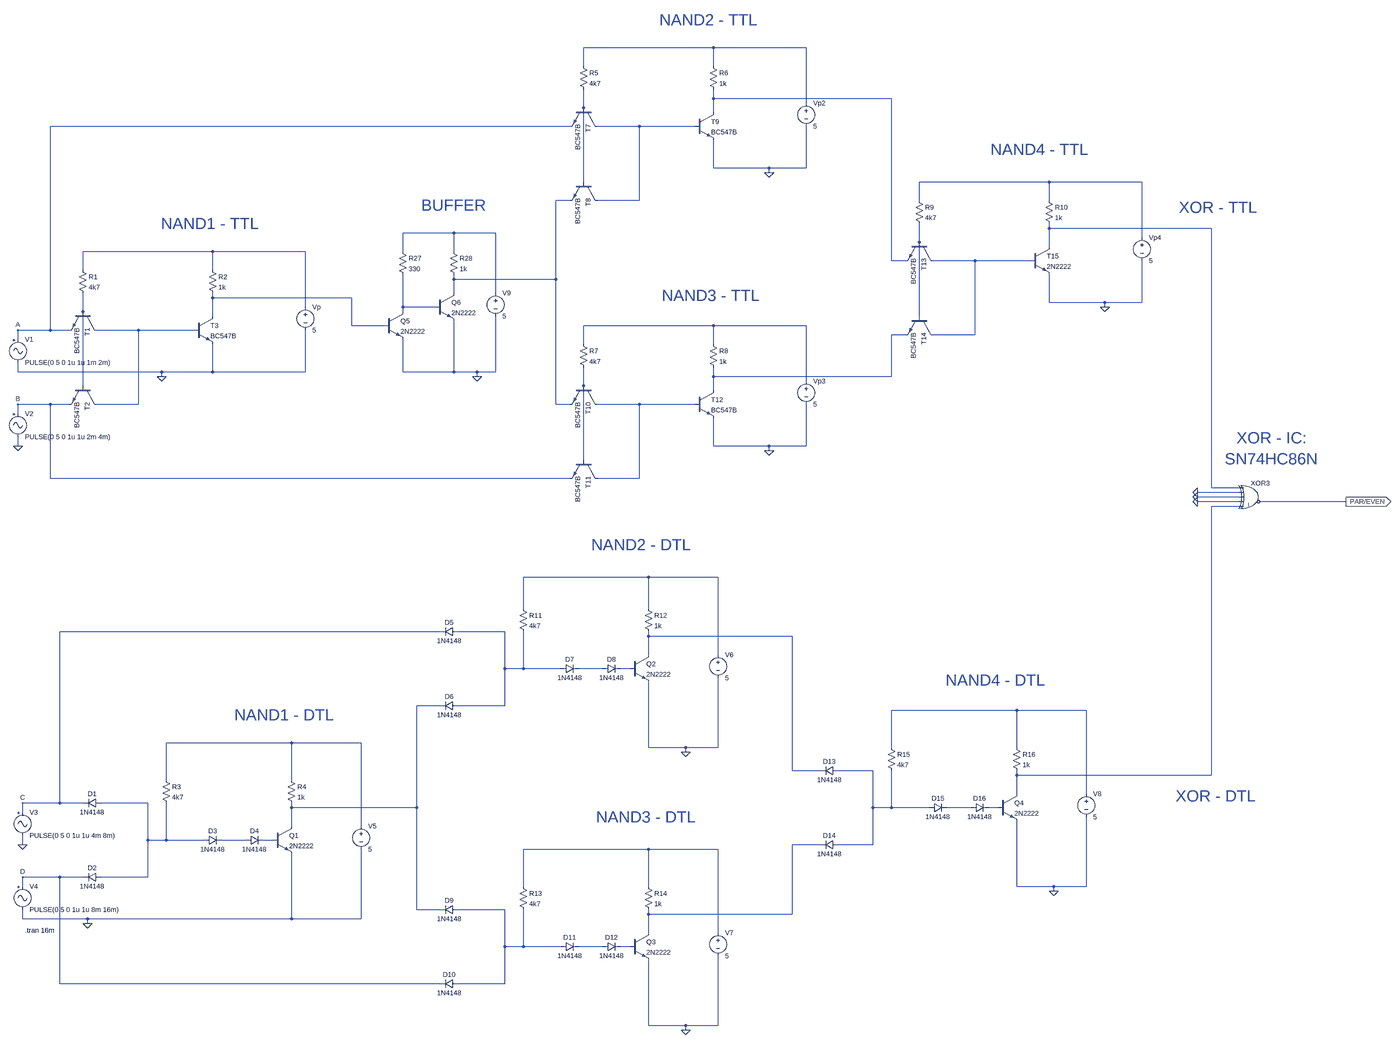
[diagram p0: schematic circuit.asc, whole sheet]
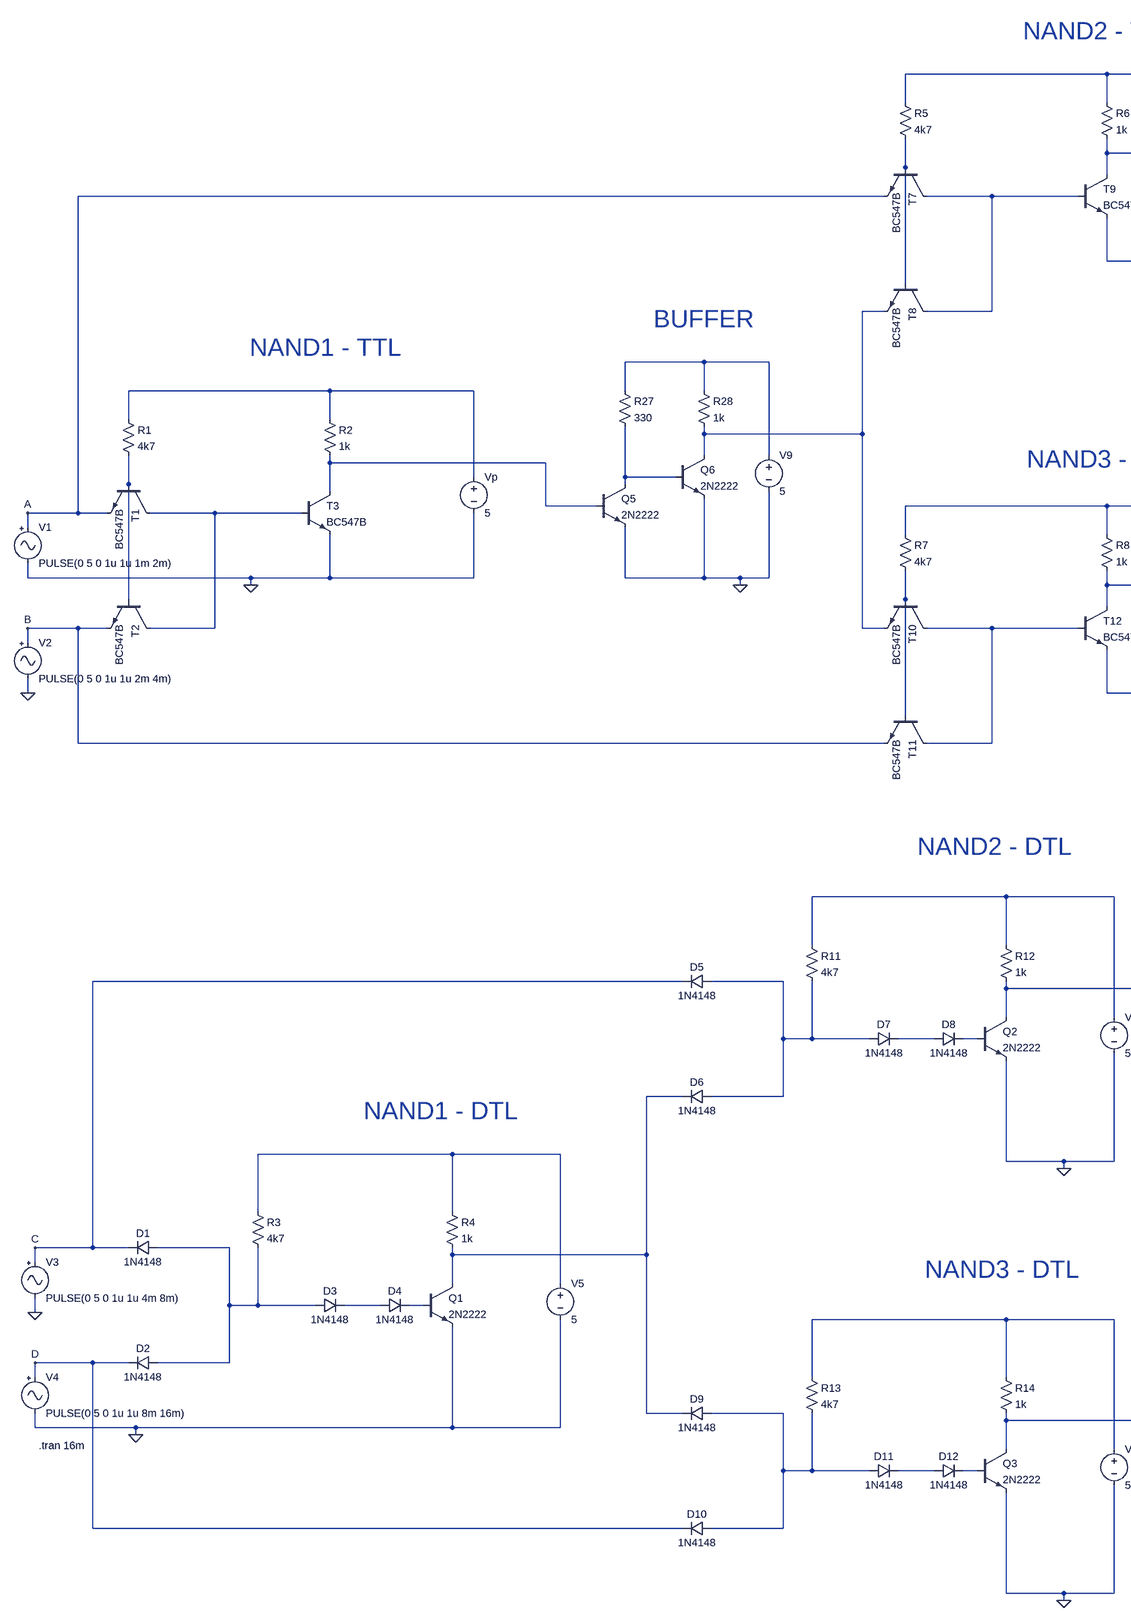
[diagram p1: schematic circuit.asc, part, row 1 of 1, column 1 of 2]
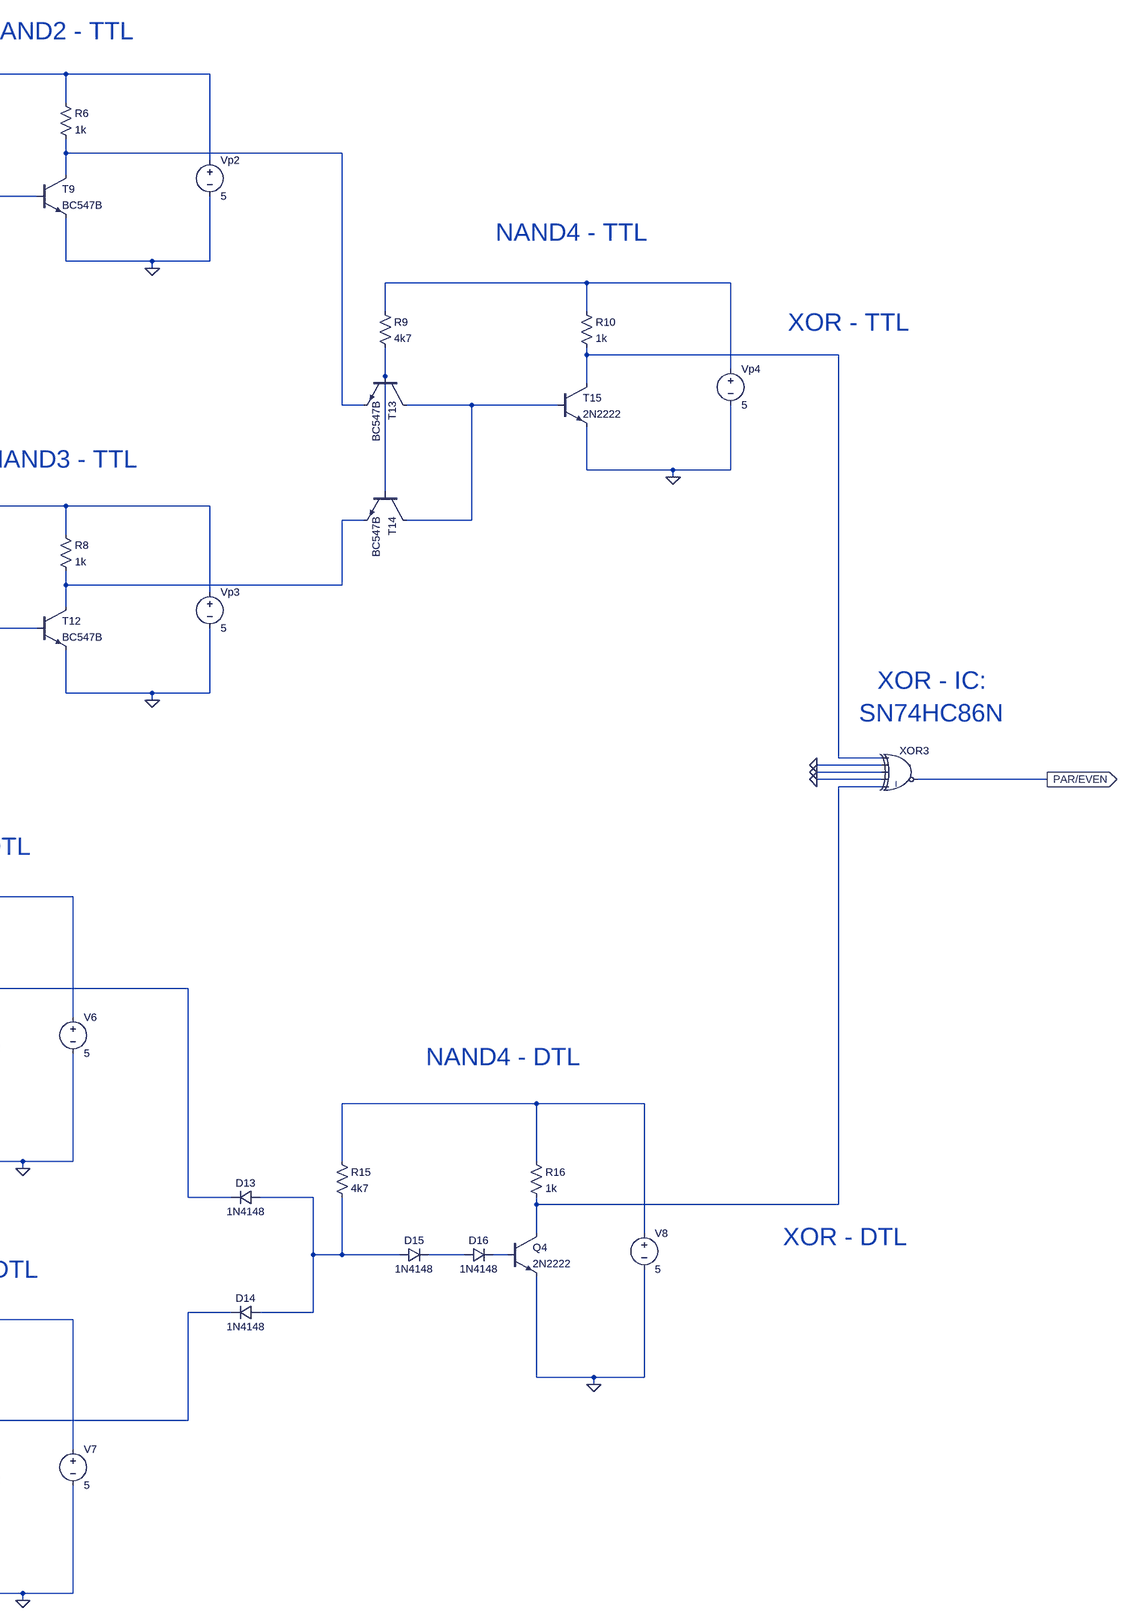
[diagram p2: schematic circuit.asc, part, row 1 of 1, column 2 of 2]
circuit.asc, the LTspice schematic file:
Version 4.1
SHEET 1 9480 2244
WIRE 1440 -1488 992 -1488
WIRE 1760 -1488 1440 -1488
WIRE 992 -1424 992 -1488
WIRE 1440 -1424 1440 -1488
WIRE 1440 -1312 1440 -1344
WIRE 2096 -1312 1440 -1312
WIRE 1760 -1296 1760 -1488
WIRE 992 -1280 992 -1344
WIRE 1440 -1264 1440 -1312
WIRE 944 -1216 -848 -1216
WIRE 1184 -1216 1040 -1216
WIRE 1376 -1216 1184 -1216
WIRE 1440 -1072 1440 -1168
WIRE 1632 -1072 1440 -1072
WIRE 1760 -1072 1760 -1216
WIRE 1760 -1072 1632 -1072
WIRE 1632 -1056 1632 -1072
WIRE 992 -1024 992 -1280
WIRE 2640 -1024 2192 -1024
WIRE 2960 -1024 2640 -1024
WIRE 944 -960 896 -960
WIRE 1184 -960 1184 -1216
WIRE 1184 -960 1040 -960
WIRE 2192 -960 2192 -1024
WIRE 2640 -960 2640 -1024
WIRE 2640 -864 2640 -880
WIRE 3200 -864 2640 -864
WIRE 544 -848 368 -848
WIRE 688 -848 544 -848
WIRE 2960 -832 2960 -1024
WIRE 2192 -816 2192 -880
WIRE 2640 -800 2640 -864
WIRE -288 -784 -736 -784
WIRE 32 -784 -288 -784
WIRE 368 -784 368 -848
WIRE 544 -784 544 -848
WIRE 2096 -752 2096 -1312
WIRE 2144 -752 2096 -752
WIRE 2384 -752 2240 -752
WIRE 2576 -752 2384 -752
WIRE -736 -720 -736 -784
WIRE -288 -720 -288 -784
WIRE 544 -688 544 -704
WIRE 896 -688 896 -960
WIRE 896 -688 544 -688
WIRE 544 -640 544 -688
WIRE 688 -640 688 -848
WIRE -288 -624 -288 -640
WIRE 192 -624 -288 -624
WIRE 2640 -608 2640 -704
WIRE 2832 -608 2640 -608
WIRE 2960 -608 2960 -752
WIRE 2960 -608 2832 -608
WIRE 32 -592 32 -784
WIRE 368 -592 368 -704
WIRE 480 -592 368 -592
WIRE 2832 -592 2832 -608
WIRE -736 -576 -736 -640
WIRE 368 -576 368 -592
WIRE -288 -560 -288 -624
WIRE 2192 -560 2192 -816
WIRE 192 -528 192 -624
WIRE 304 -528 192 -528
WIRE 1440 -528 992 -528
WIRE 1760 -528 1440 -528
WIRE -848 -512 -848 -1216
WIRE -848 -512 -960 -512
WIRE -784 -512 -848 -512
WIRE -544 -512 -688 -512
WIRE -352 -512 -544 -512
WIRE 2144 -496 2096 -496
WIRE 2384 -496 2384 -752
WIRE 2384 -496 2240 -496
WIRE -960 -480 -960 -512
WIRE 992 -464 992 -528
WIRE 1440 -464 1440 -528
WIRE -960 -368 -960 -400
WIRE -464 -368 -960 -368
WIRE -288 -368 -288 -464
WIRE -288 -368 -464 -368
WIRE 32 -368 32 -512
WIRE 32 -368 -288 -368
WIRE 368 -368 368 -480
WIRE 544 -368 544 -544
WIRE 544 -368 368 -368
WIRE 624 -368 544 -368
WIRE 688 -368 688 -560
WIRE 688 -368 624 -368
WIRE -464 -352 -464 -368
WIRE 624 -352 624 -368
WIRE 1440 -352 1440 -384
WIRE 2096 -352 2096 -496
WIRE 2096 -352 1440 -352
WIRE 1760 -336 1760 -528
WIRE -736 -320 -736 -576
WIRE 992 -320 992 -384
WIRE 1440 -304 1440 -352
WIRE -848 -256 -960 -256
WIRE -784 -256 -848 -256
WIRE -544 -256 -544 -512
WIRE -544 -256 -688 -256
WIRE 896 -256 896 -688
WIRE 944 -256 896 -256
WIRE 1184 -256 1040 -256
WIRE 1376 -256 1184 -256
WIRE -960 -224 -960 -256
WIRE -960 -112 -960 -144
WIRE 1440 -112 1440 -208
WIRE 1632 -112 1440 -112
WIRE 1760 -112 1760 -256
WIRE 1760 -112 1632 -112
WIRE 1632 -96 1632 -112
WIRE 992 -64 992 -320
WIRE -848 0 -848 -256
WIRE 944 0 -848 0
WIRE 1184 0 1184 -256
WIRE 1184 0 1040 0
WIRE 3200 32 3200 -864
WIRE 3296 32 3200 32
WIRE 3296 48 3152 48
WIRE 3296 64 3152 64
WIRE 3296 80 3152 80
WIRE 3664 80 3376 80
WIRE 3296 96 3200 96
WIRE 1216 384 784 384
WIRE 1456 384 1216 384
WIRE 784 512 784 384
WIRE 1216 512 1216 384
WIRE 496 592 -816 592
WIRE 720 592 560 592
WIRE 1216 608 1216 592
WIRE 1712 608 1216 608
WIRE 1216 672 1216 608
WIRE 1456 672 1456 384
WIRE 720 720 720 592
WIRE 784 720 784 592
WIRE 784 720 720 720
WIRE 912 720 784 720
WIRE 1056 720 976 720
WIRE 1152 720 1120 720
WIRE 496 848 416 848
WIRE 720 848 720 720
WIRE 720 848 560 848
WIRE 2528 864 2096 864
WIRE 2768 864 2528 864
WIRE -16 976 -448 976
WIRE 224 976 -16 976
WIRE 1216 992 1216 768
WIRE 1344 992 1216 992
WIRE 1456 992 1456 752
WIRE 1456 992 1344 992
WIRE 2096 992 2096 864
WIRE 2528 992 2528 864
WIRE 1344 1008 1344 992
WIRE 1712 1072 1712 608
WIRE 1808 1072 1712 1072
WIRE 2032 1072 1872 1072
WIRE 2528 1088 2528 1072
WIRE 3200 1088 3200 96
WIRE 3200 1088 2528 1088
WIRE -448 1104 -448 976
WIRE -16 1104 -16 976
WIRE 2528 1152 2528 1088
WIRE 2768 1152 2768 864
WIRE -816 1184 -816 592
WIRE -816 1184 -944 1184
WIRE -736 1184 -816 1184
WIRE -512 1184 -672 1184
WIRE -16 1200 -16 1184
WIRE 416 1200 416 848
WIRE 416 1200 -16 1200
WIRE 2032 1200 2032 1072
WIRE 2096 1200 2096 1072
WIRE 2096 1200 2032 1200
WIRE 2224 1200 2096 1200
WIRE 2368 1200 2288 1200
WIRE 2464 1200 2432 1200
WIRE -944 1216 -944 1184
WIRE -16 1264 -16 1200
WIRE 224 1264 224 976
WIRE -512 1312 -512 1184
WIRE -448 1312 -448 1184
WIRE -448 1312 -512 1312
WIRE -320 1312 -448 1312
WIRE -176 1312 -256 1312
WIRE -80 1312 -112 1312
WIRE -944 1328 -944 1296
WIRE 1808 1328 1712 1328
WIRE 2032 1328 2032 1200
WIRE 2032 1328 1872 1328
WIRE 1216 1344 784 1344
WIRE 1456 1344 1216 1344
WIRE -816 1440 -944 1440
WIRE -736 1440 -816 1440
WIRE -512 1440 -512 1312
WIRE -512 1440 -672 1440
WIRE -944 1472 -944 1440
WIRE 784 1472 784 1344
WIRE 1216 1472 1216 1344
WIRE 2528 1472 2528 1248
WIRE 2656 1472 2528 1472
WIRE 2768 1472 2768 1232
WIRE 2768 1472 2656 1472
WIRE 2656 1488 2656 1472
WIRE 416 1552 416 1200
WIRE 496 1552 416 1552
WIRE 720 1552 560 1552
WIRE 1216 1568 1216 1552
WIRE 1712 1568 1712 1328
WIRE 1712 1568 1216 1568
WIRE -944 1584 -944 1552
WIRE -720 1584 -944 1584
WIRE -16 1584 -16 1360
WIRE -16 1584 -720 1584
WIRE 224 1584 224 1344
WIRE 224 1584 -16 1584
WIRE -720 1600 -720 1584
WIRE 1216 1632 1216 1568
WIRE 1456 1632 1456 1344
WIRE 720 1680 720 1552
WIRE 784 1680 784 1552
WIRE 784 1680 720 1680
WIRE 912 1680 784 1680
WIRE 1056 1680 976 1680
WIRE 1152 1680 1120 1680
WIRE -816 1808 -816 1440
WIRE 496 1808 -816 1808
WIRE 720 1808 720 1680
WIRE 720 1808 560 1808
WIRE 1216 1952 1216 1728
WIRE 1344 1952 1216 1952
WIRE 1456 1952 1456 1712
WIRE 1456 1952 1344 1952
WIRE 1344 1968 1344 1952
FLAG -960 -112 0
FLAG 1632 -1056 0
FLAG 1632 -96 0
FLAG 2832 -592 0
FLAG -944 1328 0
FLAG 1344 1008 0
FLAG 1344 1968 0
FLAG -720 1600 0
FLAG 2656 1488 0
FLAG 3152 48 0
FLAG 3152 64 0
FLAG 3152 80 0
FLAG 3664 80 PAR/EVEN
IOPIN 3664 80 Out
FLAG -464 -352 0
FLAG 624 -352 0
FLAG -960 -512 A
FLAG -960 -256 B
FLAG -944 1184 C
FLAG -944 1440 D
SYMBOL npn -688 -576 R90
SYMATTR InstName T1
SYMATTR Value BC547B
SYMBOL npn -688 -320 R90
SYMATTR InstName T2
SYMATTR Value BC547B
SYMBOL npn -352 -560 R0
SYMATTR InstName T3
SYMATTR Value BC547B
SYMBOL res -752 -736 R0
SYMATTR InstName R1
SYMATTR Value 4k7
SYMBOL res -304 -736 R0
SYMATTR InstName R2
SYMATTR Value 1k
SYMBOL Misc\\signal -960 -496 R0
WINDOW 123 0 0 Left 0
WINDOW 39 0 0 Left 0
SYMATTR InstName V1
SYMATTR Value PULSE(0 5 0 1u 1u 1m 2m)
SYMBOL voltage 32 -608 R0
WINDOW 123 0 0 Left 0
WINDOW 39 24 44 Left 2
SYMATTR InstName Vp
SYMATTR Value 5
SYMBOL Misc\\signal -960 -240 R0
WINDOW 123 0 0 Left 0
WINDOW 39 0 0 Left 0
SYMATTR InstName V2
SYMATTR Value PULSE(0 5 0 1u 1u 2m 4m)
SYMBOL npn 1040 -1280 R90
SYMATTR InstName T7
SYMATTR Value BC547B
SYMBOL npn 1040 -1024 R90
SYMATTR InstName T8
SYMATTR Value BC547B
SYMBOL npn 1376 -1264 R0
SYMATTR InstName T9
SYMATTR Value BC547B
SYMBOL res 976 -1440 R0
SYMATTR InstName R5
SYMATTR Value 4k7
SYMBOL res 1424 -1440 R0
SYMATTR InstName R6
SYMATTR Value 1k
SYMBOL voltage 1760 -1312 R0
WINDOW 123 0 0 Left 0
WINDOW 39 24 44 Left 2
SYMATTR InstName Vp2
SYMATTR Value 5
SYMBOL npn 1040 -320 R90
SYMATTR InstName T10
SYMATTR Value BC547B
SYMBOL npn 1040 -64 R90
SYMATTR InstName T11
SYMATTR Value BC547B
SYMBOL npn 1376 -304 R0
SYMATTR InstName T12
SYMATTR Value BC547B
SYMBOL res 976 -480 R0
SYMATTR InstName R7
SYMATTR Value 4k7
SYMBOL res 1424 -480 R0
SYMATTR InstName R8
SYMATTR Value 1k
SYMBOL voltage 1760 -352 R0
WINDOW 123 0 0 Left 0
WINDOW 39 24 44 Left 2
SYMATTR InstName Vp3
SYMATTR Value 5
SYMBOL npn 2240 -816 R90
SYMATTR InstName T13
SYMATTR Value BC547B
SYMBOL npn 2240 -560 R90
SYMATTR InstName T14
SYMATTR Value BC547B
SYMBOL npn 2576 -800 R0
SYMATTR InstName T15
SYMATTR Value 2N2222
SYMBOL res 2176 -976 R0
SYMATTR InstName R9
SYMATTR Value 4k7
SYMBOL res 2624 -976 R0
SYMATTR InstName R10
SYMATTR Value 1k
SYMBOL voltage 2960 -848 R0
WINDOW 123 0 0 Left 0
WINDOW 39 24 44 Left 2
SYMATTR InstName Vp4
SYMATTR Value 5
SYMBOL Misc\\signal -944 1200 R0
WINDOW 123 0 0 Left 0
WINDOW 39 0 0 Left 0
SYMATTR InstName V3
SYMATTR Value PULSE(0 5 0 1u 1u 4m 8m)
SYMBOL Misc\\signal -944 1456 R0
WINDOW 123 0 0 Left 0
WINDOW 39 0 0 Left 0
SYMATTR InstName V4
SYMATTR Value PULSE(0 5 0 1u 1u 8m 16m)
SYMBOL diode -672 1168 R90
WINDOW 0 0 32 VBottom 2
WINDOW 3 32 32 VTop 2
SYMATTR InstName D1
SYMATTR Value 1N4148
SYMBOL diode -672 1424 R90
WINDOW 0 0 32 VBottom 2
WINDOW 3 32 32 VTop 2
SYMATTR InstName D2
SYMATTR Value 1N4148
SYMBOL res -464 1088 R0
SYMATTR InstName R3
SYMATTR Value 4k7
SYMBOL diode -320 1328 R270
WINDOW 0 32 32 VTop 2
WINDOW 3 0 32 VBottom 2
SYMATTR InstName D3
SYMATTR Value 1N4148
SYMBOL diode -176 1328 R270
WINDOW 0 32 32 VTop 2
WINDOW 3 0 32 VBottom 2
SYMATTR InstName D4
SYMATTR Value 1N4148
SYMBOL npn -80 1264 R0
SYMATTR InstName Q1
SYMATTR Value 2N2222
SYMBOL res -32 1088 R0
SYMATTR InstName R4
SYMATTR Value 1k
SYMBOL voltage 224 1248 R0
SYMATTR InstName V5
SYMATTR Value 5
SYMBOL diode 560 576 R90
WINDOW 0 0 32 VBottom 2
WINDOW 3 32 32 VTop 2
SYMATTR InstName D5
SYMATTR Value 1N4148
SYMBOL diode 560 832 R90
WINDOW 0 0 32 VBottom 2
WINDOW 3 32 32 VTop 2
SYMATTR InstName D6
SYMATTR Value 1N4148
SYMBOL res 768 496 R0
SYMATTR InstName R11
SYMATTR Value 4k7
SYMBOL diode 912 736 R270
WINDOW 0 32 32 VTop 2
WINDOW 3 0 32 VBottom 2
SYMATTR InstName D7
SYMATTR Value 1N4148
SYMBOL diode 1056 736 R270
WINDOW 0 32 32 VTop 2
WINDOW 3 0 32 VBottom 2
SYMATTR InstName D8
SYMATTR Value 1N4148
SYMBOL npn 1152 672 R0
SYMATTR InstName Q2
SYMATTR Value 2N2222
SYMBOL res 1200 496 R0
SYMATTR InstName R12
SYMATTR Value 1k
SYMBOL voltage 1456 656 R0
SYMATTR InstName V6
SYMATTR Value 5
SYMBOL diode 560 1536 R90
WINDOW 0 0 32 VBottom 2
WINDOW 3 32 32 VTop 2
SYMATTR InstName D9
SYMATTR Value 1N4148
SYMBOL diode 560 1792 R90
WINDOW 0 0 32 VBottom 2
WINDOW 3 32 32 VTop 2
SYMATTR InstName D10
SYMATTR Value 1N4148
SYMBOL res 768 1456 R0
SYMATTR InstName R13
SYMATTR Value 4k7
SYMBOL diode 912 1696 R270
WINDOW 0 32 32 VTop 2
WINDOW 3 0 32 VBottom 2
SYMATTR InstName D11
SYMATTR Value 1N4148
SYMBOL diode 1056 1696 R270
WINDOW 0 32 32 VTop 2
WINDOW 3 0 32 VBottom 2
SYMATTR InstName D12
SYMATTR Value 1N4148
SYMBOL npn 1152 1632 R0
SYMATTR InstName Q3
SYMATTR Value 2N2222
SYMBOL res 1200 1456 R0
SYMATTR InstName R14
SYMATTR Value 1k
SYMBOL voltage 1456 1616 R0
SYMATTR InstName V7
SYMATTR Value 5
SYMBOL diode 1872 1056 R90
WINDOW 0 0 32 VBottom 2
WINDOW 3 32 32 VTop 2
SYMATTR InstName D13
SYMATTR Value 1N4148
SYMBOL diode 1872 1312 R90
WINDOW 0 0 32 VBottom 2
WINDOW 3 32 32 VTop 2
SYMATTR InstName D14
SYMATTR Value 1N4148
SYMBOL res 2080 976 R0
SYMATTR InstName R15
SYMATTR Value 4k7
SYMBOL diode 2224 1216 R270
WINDOW 0 32 32 VTop 2
WINDOW 3 0 32 VBottom 2
SYMATTR InstName D15
SYMATTR Value 1N4148
SYMBOL diode 2368 1216 R270
WINDOW 0 32 32 VTop 2
WINDOW 3 0 32 VBottom 2
SYMATTR InstName D16
SYMATTR Value 1N4148
SYMBOL npn 2464 1152 R0
SYMATTR InstName Q4
SYMATTR Value 2N2222
SYMBOL res 2512 976 R0
SYMATTR InstName R16
SYMATTR Value 1k
SYMBOL voltage 2768 1136 R0
SYMATTR InstName V8
SYMATTR Value 5
SYMBOL npn 304 -576 R0
SYMATTR InstName Q5
SYMATTR Value 2N2222
SYMBOL npn 480 -640 R0
SYMATTR InstName Q6
SYMATTR Value 2N2222
SYMBOL res 352 -800 R0
SYMATTR InstName R27
SYMATTR Value 330
SYMBOL res 528 -800 R0
SYMATTR InstName R28
SYMATTR Value 1k
SYMBOL voltage 688 -656 R0
SYMATTR InstName V9
SYMATTR Value 5
SYMBOL Digital\\xor 3344 0 R0
SYMATTR InstName XOR3
TEXT -936 1624 Left 2 !.tran 16m
TEXT -296 -880 Center 5 ;NAND1 - TTL
TEXT 432 -944 Left 5 ;BUFFER
TEXT 1424 -1584 Center 5 ;NAND2 - TTL
TEXT 1432 -632 Center 5 ;NAND3 - TTL
TEXT 2608 -1136 Center 5 ;NAND4 - TTL
TEXT -40 880 Center 5 ;NAND1 - DTL
TEXT 1192 272 Center 5 ;NAND2 - DTL
TEXT 1208 1232 Center 5 ;NAND3 - DTL
TEXT 2456 760 Center 5 ;NAND4 - DTL
TEXT 3224 -936 Center 5 ;XOR - TTL
TEXT 3216 1160 Center 5 ;XOR - DTL
TEXT 3408 -104 Center 5 ;XOR - IC:\nSN74HC86N

The netlist it stands for:
* circuit.asc
Q§T1 N016 N014 A 0 BC547B
Q§T2 N016 N014 B 0 BC547B
Q§T3 N012 N016 0 0 BC547B
R1 N010 N014 4k7
R2 N010 N012 1k
V1 A 0 PULSE(0 5 0 1u 1u 1m 2m)
Vp N010 0 5
V2 B 0 PULSE(0 5 0 1u 1u 2m 4m)
Q§T7 N004 N003 A 0 BC547B
Q§T8 N004 N003 N006 0 BC547B
Q§T9 N002 N004 0 0 BC547B
R5 N001 N003 4k7
R6 N001 N002 1k
Vp2 N001 0 5
Q§T10 N019 N018 N006 0 BC547B
Q§T11 N019 N018 B 0 BC547B
Q§T12 N017 N019 0 0 BC547B
R7 N015 N018 4k7
R8 N015 N017 1k
Vp3 N015 0 5
Q§T13 N011 N009 N002 0 BC547B
Q§T14 N011 N009 N017 0 BC547B
Q§T15 N007 N011 0 0 2N2222
R9 N005 N009 4k7
R10 N005 N007 1k
Vp4 N005 0 5
V3 C 0 PULSE(0 5 0 1u 1u 4m 8m)
V4 D 0 PULSE(0 5 0 1u 1u 8m 16m)
D1 N030 C 1N4148
D2 N030 D 1N4148
R3 N028 N030 4k7
D3 N030 N033 1N4148
D4 N033 N034 1N4148
Q1 N026 N034 0 0 2N2222
R4 N028 N026 1k
V5 N028 0 5
D5 N022 C 1N4148
D6 N022 N026 1N4148
R11 N021 N022 4k7
D7 N022 N024 1N4148
D8 N024 N025 1N4148
Q2 N023 N025 0 0 2N2222
R12 N021 N023 1k
V6 N021 0 5
D9 N037 N026 1N4148
D10 N037 D 1N4148
R13 N036 N037 4k7
D11 N037 N038 1N4148
D12 N038 N039 1N4148
Q3 N035 N039 0 0 2N2222
R14 N036 N035 1k
V7 N036 0 5
D13 N029 N023 1N4148
D14 N029 N035 1N4148
R15 N027 N029 4k7
D15 N029 N031 1N4148
D16 N031 N032 1N4148
Q4 N020 N032 0 0 2N2222
R16 N027 N020 1k
V8 N027 0 5
Q5 N013 N012 0 0 2N2222
Q6 N006 N013 0 0 2N2222
R27 N008 N013 330
R28 N008 N006 1k
V9 N008 0 5
A§XOR3 N007 0 0 0 N020 PAR/EVEN 0 0 XOR
.model D D
.lib standard.dio
.model NPN NPN
.model PNP PNP
.lib standard.bjt
.tran 16m
* NAND1 - TTL
* BUFFER
* NAND2 - TTL
* NAND3 - TTL
* NAND4 - TTL
* NAND1 - DTL
* NAND2 - DTL
* NAND3 - DTL
* NAND4 - DTL
* XOR - TTL
* XOR - DTL
* XOR - IC:
* SN74HC86N
.backanno
.end